# Altium schematic sheet LTS15-NP 8Aac ADC 센싱회로1.SchDoc: 8A Sensing Circuit for LTS15-NP
size A4
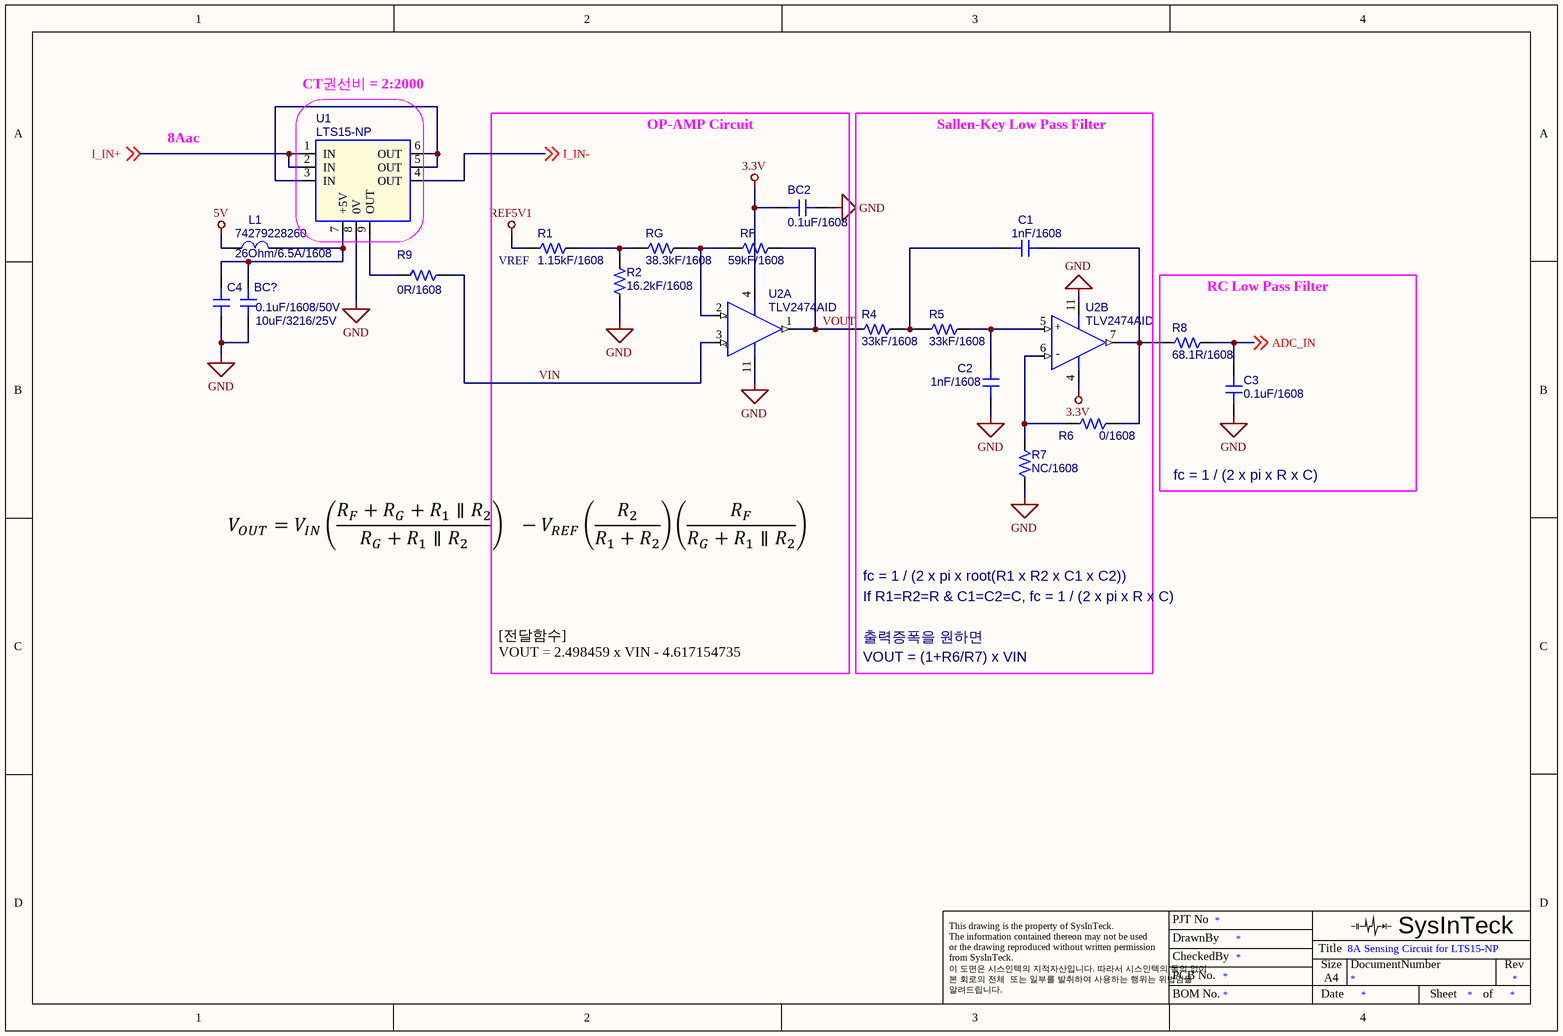
[diagram p0: LTS15-NP 8Aac ADC 센싱회로1.SchDoc]

## Parts
BC2  0.1uF/1608  [C-1608]
BC?  0.1uF/1608/50V  [C-1608]
C1  1nF/1608  [C-1608]
C2  1nF/1608  [C-1608]
C3  0.1uF/1608  [C-1608]
C4  10uF/3216/25V  [C-3216]
L1  74279228260  PN: 26Ohm/6.5A/1608  [L-1608]
R1  1.15kF/1608  [R-1608]
R2  16.2kF/1608  [R-1608]
R4  33kF/1608  [R-1608]
R5  33kF/1608  [R-1608]
R6  0/1608  [R-1608]
R7  NC/1608  [R-1608]
R8  68.1R/1608  [R-1608]
R9  0R/1608  [R-1608]
RF  59kF/1608  [R-1608]
RG  38.3kF/1608  [R-1608]
U1  LTS15-NP  [LEM-LTS]
U2  TLV2474AID  [SO-14]  (parts A,B of 4)

## Blocks framed on the sheet
CT권선비 = 2:2000: U1
OP-AMP Circuit: BC2 R1 R2 RF RG U2

## Nets
3.3V: BC2.2 U2.4(+VCC)
5V: L1.1
GND: BC2.1 BC?.1 C2.2 C3.2 C4.1 R2.1 R7.1 U1.8(0V) U2.11(-VCC)
REF5V1: R1.1
ADC_IN: C3.1 R8.2 ; off-sheet ADC_IN
I_IN+: U1.1(IN) U1.2(IN) ; off-sheet I_IN+
I_IN-: U1.4(OUT) ; off-sheet I_IN-
VIN: R9.1 U2.3(+IN)
VOUT: R4.1 RF.2 U2.1(OUT)
NetBC?_2: BC?.2 C4.2 L1.2 U1.7(+5V)
NetC1_1: C1.1 R6.2 R8.1 U2.7(OUT)
NetC1_2: C1.2 R4.2 R5.1
NetC2_1: C2.1 R5.2 U2.5(+IN)
NetR1_2: R1.2 R2.2 RG.1
NetR6_1: R6.1 R7.2 U2.6(-IN)
NetR9_2: R9.2 U1.9(OUT)
NetRF_1: RF.1 RG.2 U2.2(-IN)
NetU1_3: U1.3(IN) U1.5(OUT) U1.6(OUT)

## Notes on the sheet
- 8Aac
- Sallen-Key Low Pass Filter
- (near R1) VREF
- (near R8) RC Low Pass Filter
- fc = 1 / (2 x pi x R x C)
- fc = 1 / (2 x pi x root(R1 x R2 x C1 x C2))
- If R1=R2=R & C1=C2=C, fc = 1 / (2 x pi x R x C)
- 출력증폭을 원하면
- [전달함수]
  VOUT = 2.498459 x VIN - 4.617154735
- VOUT = (1+R6/R7) x VIN
- PJT No
- This drawing is the property of SysInTeck.
- The information contained thereon may not be used
- or the drawing reproduced without written permission
- from SysInTeck.
- 이 도면은 시스인텍의 지적자산입니다. 따라서 시스인텍의 동의 없이
- 본 회로의 전체  또는 일부를 발취하여 사용하는 행위는 위법임을
- 알려드립니다.
- DrawnBy
- CheckedBy
- PCB No.
- Title
- Size
- A4
- DocumentNumber
- SysInTeck
- Rev
- BOM No.
- Date
- Sheet
- of
- (in symbol OPA4336_1, part A) -; +
- (in symbol OPA4336_1, part B) +; -

## Library data of the parts
BC2 C1-C3 = CAPACITOR NON-POL: PCB Footprint: C-1608
BC? C4 = CAPACITOR NON-POL_1
  BC?: PCB Footprint: C-1608
  C4: PCB Footprint: C-3216
L1 = INDUCTOR_2: PCB Footprint: L-1608
R1 R2 R4-R8 RF RG = R_Dup: Resistor; OriginalSymbolOrigin: (0,0); PSpiceTemplate: R^@REFDES %1 %2 ?TOLERANCE|R^@REFDES| @VALUE  ?TOLERANCE|\n.model R^@REFDES RES R=1 DEV=@TOLERANCE%|; Value: 22.1RF/1608; PCB Footprint: R-1608
R9 = R_Dup1: OriginalSymbolOrigin: (0,0); PSpiceTemplate: R^@REFDES %1 %2 ?TOLERANCE|R^@REFDES| @VALUE  ?TOLERANCE|\n.model R^@REFDES RES R=1 DEV=@TOLERANCE%|; Value: 0/1608/0.1%; PCB Footprint: R-1608
U1 = LTS6-NP_2: PCB Footprint: LEM-LTS
U2 = OPA4336_1: PCB Footprint: SO-14